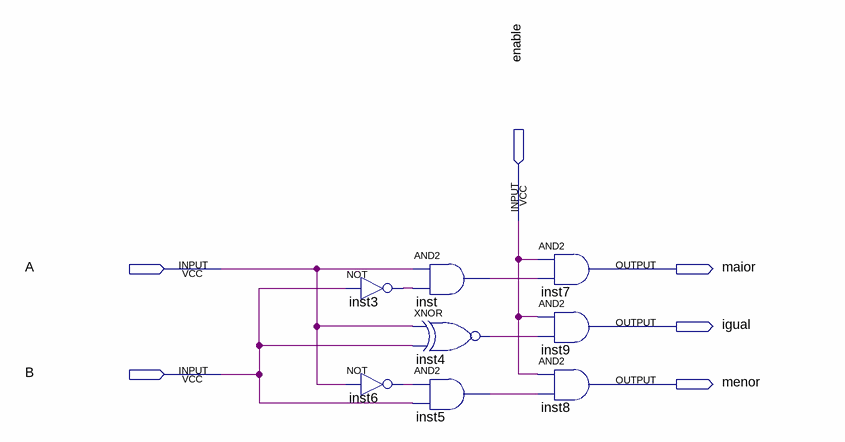
[diagram p0: schematic sheet]
// Quartus schematic comparador1bit.bdf as structural Verilog: 8 symbols, 6 pins
module comparador1bit (
  input  enable,
  input  A,
  input  B,
  output maior,
  output igual,
  output menor
);

  wire inst3_out, inst4_out, inst5_out, inst6_out, inst_out;

  not inst3 (inst3_out, B);
  not inst6 (inst6_out, A);
  and inst (inst_out, A, inst3_out);
  xnor inst4 (inst4_out, A, B);
  and inst5 (inst5_out, inst6_out, B);
  and inst7 (maior, enable, inst_out);
  and inst9 (igual, enable, inst4_out);
  and inst8 (menor, enable, inst5_out);
endmodule
